# Altium schematic sheet LEDs.SchDoc
size A4
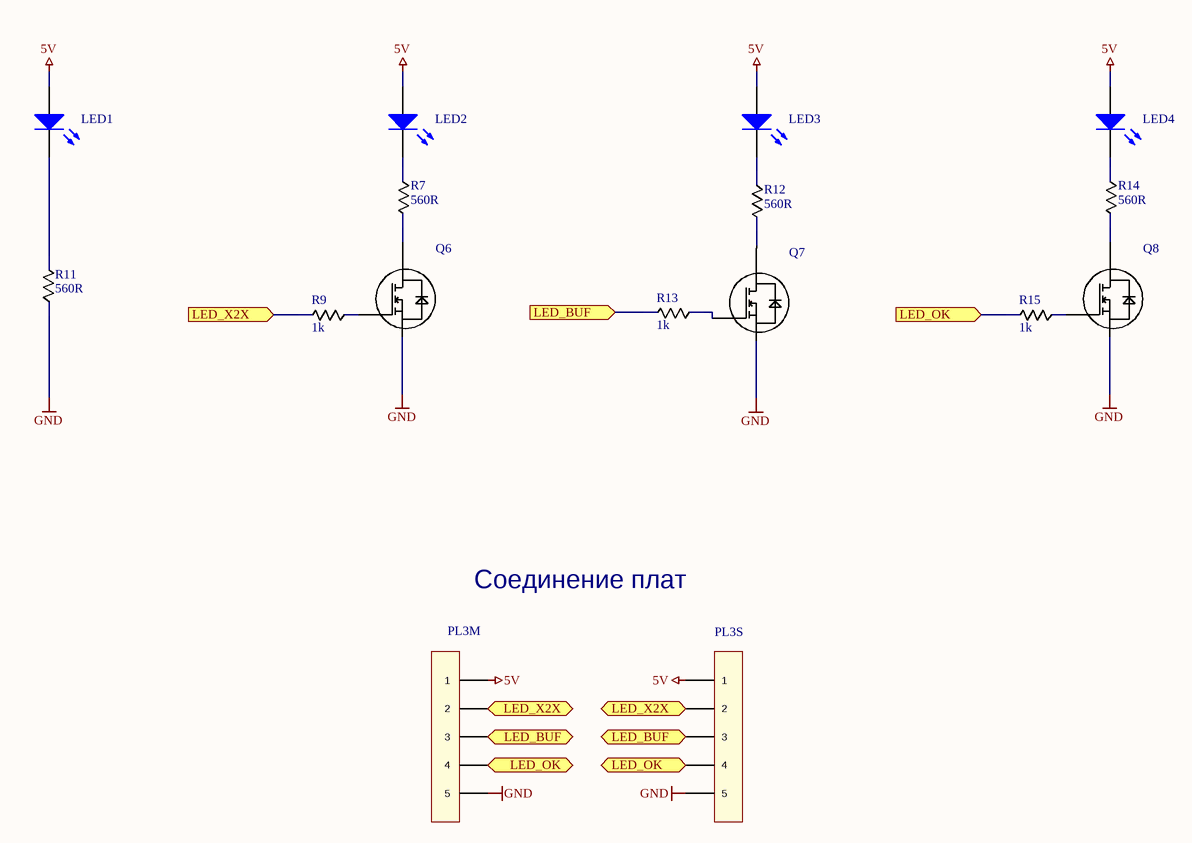
[diagram p0: LEDs.SchDoc]

## Parts
LED1  LED Green  [0603]  (value not drawn)
LED2  LED Green  [0603]  (value not drawn)
LED3  LED Green  [0603]  (value not drawn)
LED4  LED Green  [0603]  (value not drawn)
PL3M  Pin Line  [PLS-5 2.54]  (value not drawn)  (no BOM)
PL3S  Pin Line  [PLS-5 2.54 - Part]  (value not drawn)
Q6  MOSFET-N  [SOT23]  (value not drawn)
Q7  MOSFET-N  [SOT23]  (value not drawn)
Q8  MOSFET-N  [SOT23]  (value not drawn)
R7  560R  [0603]
R9  1k  [0603]
R11  560R  [0603]
R12  560R  [0603]
R13  1k  [0603]
R14  560R  [0603]
R15  1k  [0603]

## Ports
LED_BUF, LED_OK, LED_X2X

## Nets
5V: LED1.1(A) LED2.1(A) LED3.1(A) LED4.1(A) PL3M.1 PL3S.1
GND: PL3M.5 PL3S.5 Q6.2(S) Q7.2(S) Q8.2(S) R11.1
LED_BUF: PL3M.3 PL3S.3 R13.2 ; port LED_BUF
LED_OK: PL3M.4 PL3S.4 R15.2 ; port LED_OK
LED_X2X: PL3M.2 PL3S.2 R9.2 ; port LED_X2X
NetLED1_2: LED1.2(K) R11.2
NetLED2_2: LED2.2(K) R7.1
NetLED3_2: LED3.2(K) R12.1
NetLED4_2: LED4.2(K) R14.1
NetQ6_1: Q6.1(G) R9.1
NetQ6_3: Q6.3(D) R7.2
NetQ7_1: Q7.1(G) R13.1
NetQ7_3: Q7.3(D) R12.2
NetQ8_1: Q8.1(G) R15.1
NetQ8_3: Q8.3(D) R14.2

## Notes on the sheet
- Соединение плат

## Library data of the parts
LED1-LED4 = 0603 LED: KP-1608SGC; Published: 8-Jun-2000; LatestRevisionDate: 08-Jul-2005; LatestRevisionNote: Mech Layer 1 removed.; PackageReference: LED-0; Publisher: Altium Limited; PackageDescription: LED; 2 Leads
PL3M PL3S = PLS-5: PLS-5 2.54
Q6-Q8 = BSS138: IRLML2502TR
R7 R11 R12 R14 = 0603 RES: RC0603JR-07560RL
R9 R13 R15 = 0603 RES: RC0603FR-071KL